# Altium project PCB_Project.PrjPcb
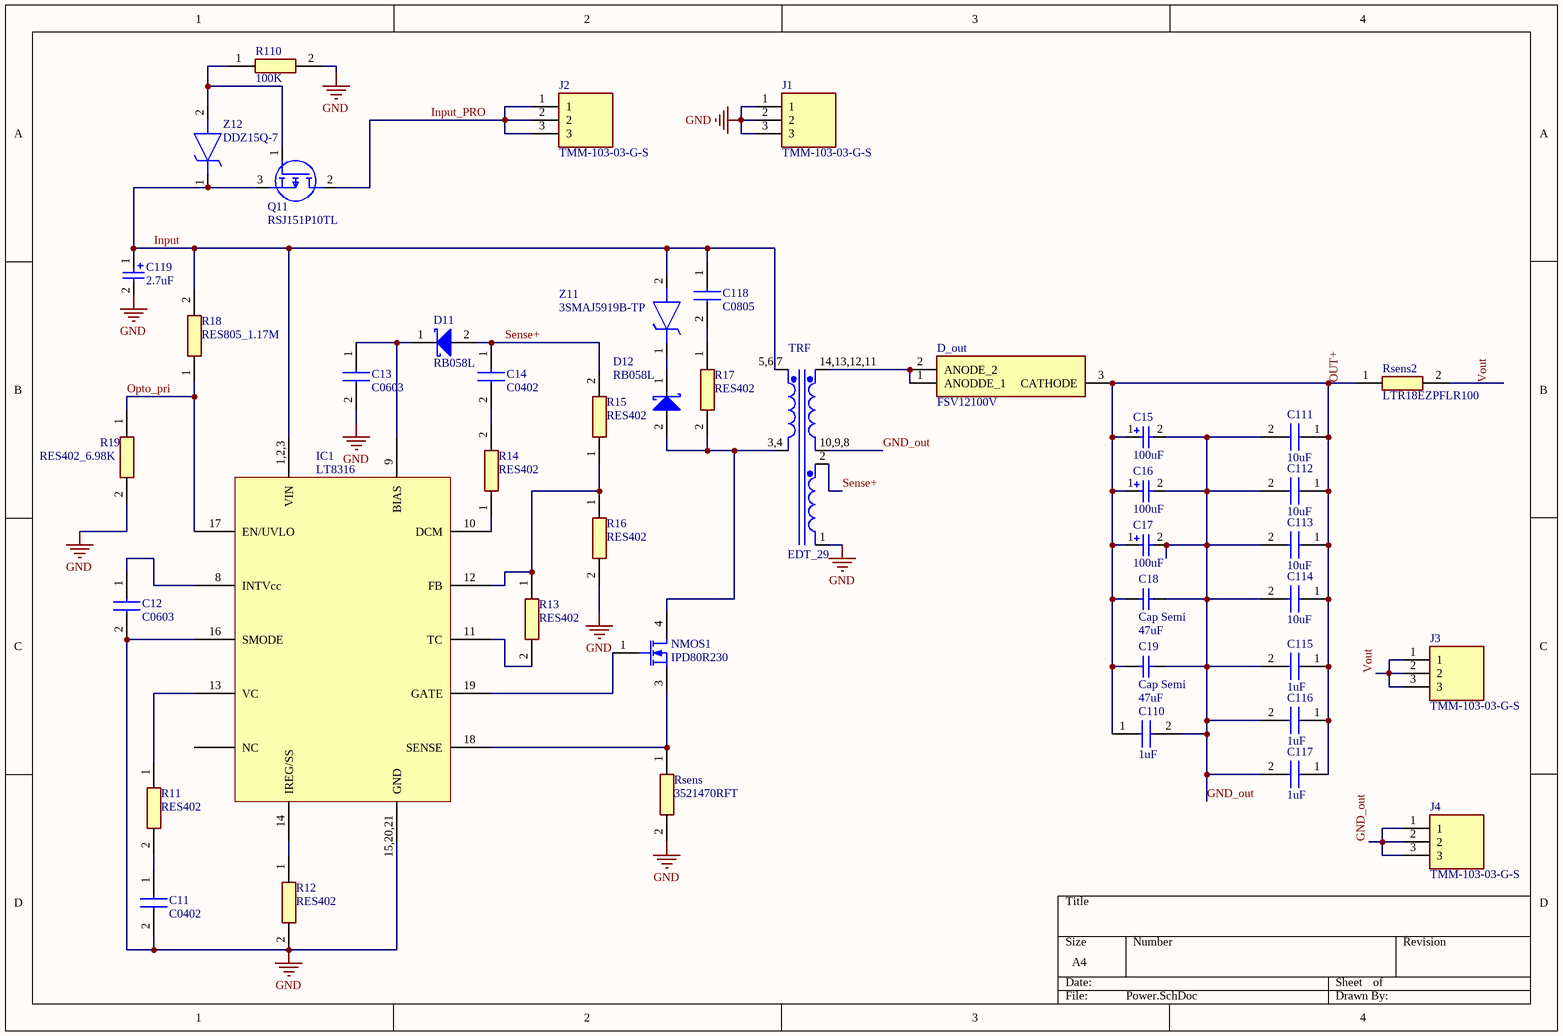
[diagram p0: Power.SchDoc]
2 sheets, 69 parts. Net scope: global (net labels, ports and power ports of the same name join across sheets).
Board file: PCB1.PcbDoc
Sheets:
  Power.SchDoc
  Control.SchDoc

## Sheet Power.SchDoc
size A4; SheetNumber: 1; SheetTotal: 2

### Parts
C11  C0402  [CAPC1005X55N]
C12  C0603  [CAPC1608X90N]
C13  C0603  [CAPC1608X90N]
C14  C0402  [CAPC1005X55N]
C15  100uF  [CAPAEDH107M016A9G]
C16  100uF  [CAPAEDH107M016A9G]
C17  100uF  [CAPAEDH107M016A9G]
C18  Cap Semi  value 47uF  [C1206]
C19  Cap Semi  value 47uF  [C1206]
C110  1uF  [CAPC1608X90N]
C111  10uF  [CAPC2012X145N]
C112  10uF  [CAPC2012X145N]
C113  10uF  [CAPC2012X145N]
C114  10uF  [CAPC2012X145N]
C115  1uF  [CAPC1608X90N]
C116  1uF  [CAPC1608X90N]
C117  1uF  [CAPC1608X90N]
C118  C0805  [CAPC2012X145N]
C119  2.7uF  [CAPAE127P600-8N]
D11  RB058L  [RB058L]
D12  RB058L  [RB058L]
D_out  FSV12100V  [FSV1045V]
IC1  LT8316  [TSOP65P640X120-20N]
J1  TMM-103-03-G-S  [HDRV3W50P0X200_1X3_600X197X550P]
J2  TMM-103-03-G-S  [HDRV3W50P0X200_1X3_600X197X550P]
J3  TMM-103-03-G-S  [HDRV3W50P0X200_1X3_600X197X550P]
J4  TMM-103-03-G-S  [HDRV3W50P0X200_1X3_600X197X550P]
NMOS1  IPD80R230  [DPAK228P994X241-3N]
Q11  RSJ151P10TL  [RSJ151P10TL]
R11  RES402  [ERJ2RKD1004X]
R12  RES402  [ERJ2RKD1004X]
R13  RES402  [ERJ2RKD1004X]
R14  RES402  [ERJ2RKD1004X]
R15  RES402  [ERJ2RKD1004X]
R16  RES402  [ERJ2RKD1004X]
R17  RES402  [ERJ2RKD1004X]
R18  RES805_1.17M  [RESC2012X50N]
R19  RES402_6.98K  [ERJ2RKD1004X]
R110  100K  [ERJ2RKD1004X]
Rsens  3521470RFT  [RESC6332X65N]
Rsens2  LTR18EZPFLR100  [RESC1632X68N]
TRF  EDT_29  [PCBComponent_1]
Z11  3SMAJ5919B-TP  [DIOM5226X244N]
Z12  DDZ15Q-7  [SOD3716X145N]

### Nets
GND: C11.2 C12.2 C13.2 C119.2(CAP-) IC1.15,20,21(GND) IC1.16(SMODE) J1.1 J1.2 J1.3 R12.2 R16.2 R19.2 R110.2 Rsens.2 TRF.1(Sec2-)
GND_out: C15.2(CAP-) C16.2(CAP-) C17.2(CAP-) C18.2 C19.2 C110.2 C111.2 C112.2 C113.2 C114.2 C115.2 C116.2 C117.2 J4.1 J4.2 J4.3 TRF.10,9,8(Sec1-)
Input: C118.1 C119.1(Cap+) IC1.1,2,3(VIN) Q11.3(S) R18.2 TRF.5,6,7(Pri+) Z11.2(A) Z12.1(K)
Input_PRO: J2.1 J2.2 J2.3 Q11.2(D)
Opto_pri: IC1.17(EN/UVLO) R18.1 R19.1
OUT+: C15.1(Cap+) C16.1(Cap+) C17.1(Cap+) C18.1 C19.1 C110.1 C111.1 C112.1 C113.1 C114.1 C115.1 C116.1 C117.1 D_out.3(CATHODE) Rsens2.1
Sense+: C14.1 D11.2(A) R15.2 TRF.2(Sec2+)
Vout: J3.1 J3.2 J3.3 Rsens2.2
NetC11_1: C11.1 R11.2
NetC12_1: C12.1 IC1.8(INTVcc)
NetC13_1: C13.1 D11.1(K) IC1.9(BIAS)
NetC14_2: C14.2 R14.2
NetC118_2: C118.2 R17.1
NetD12_1: D12.1(K) Z11.1(K)
NetD12_2: D12.2(A) NMOS1.4(D) R17.2 TRF.3,4(Pri-)
NetD_out_1: D_out.1(ANODDE_1) D_out.2(ANODE_2) TRF.14,13,12,11(Sec1+)
NetIC1_10: IC1.10(DCM) R14.1
NetIC1_11: IC1.11(TC) R13.2
NetIC1_12: IC1.12(FB) R13.1 R15.1 R16.1
NetIC1_13: IC1.13(VC) R11.1
NetIC1_14: IC1.14(IREG/SS) R12.1
NetIC1_18: IC1.18(SENSE) NMOS1.3(S) Rsens.1
NetIC1_19: IC1.19(GATE) NMOS1.1(G)
NetQ11_1: Q11.1(G) R110.1 Z12.2(A)

Not connected (* = marked no-connect by the designer): IC1 4,5,6,7(NC)

### Library data of the parts
C11 C14 = C0402C829D3GACTU: Capacitor; Manufacturer_Name: Kemet; Datasheet Link: https://content.kemet.com/datasheets/KEM_C1002_X7R_SMD.pdf; Height: 0.55mm; Manufacturer_Part_Number: C0402C829D3GACTU; Mouser Part Number: 80-C0402C829D3G; Mouser Price/Stock: https://www.mouser.co.uk/ProductDetail/KEMET/C0402C829D3GACTU?qs=ezuqA1hLDjkKgrGbHuNb0A%3D%3D; Arrow Part Number: C0402C829D3GACTU; Arrow Price/Stock: https://www.arrow.com/en/products/c0402c829d3gactu/kemet-corporation
C12 C13 C110 C115-C117 = CC0603KRX7R7BB103: Capacitor; Manufacturer_Name: YAGEO (PHYCOMP); Datasheet Link: http://www.yageo.com/documents/recent/UPY-GPHC_X7R_6.3V-to-50V_18.pdf; Height: 0.9mm; Manufacturer_Part_Number: CC0603KRX7R7BB103; Mouser Part Number: 603-CC603KRX7R7BB103; Mouser Price/Stock: https://www.mouser.co.uk/ProductDetail/Yageo/CC0603KRX7R7BB103?qs=5q%252BqlK8CmJRarFmz5k060w%3D%3D; Arrow Part Number: CC0603KRX7R7BB103; Arrow Price/Stock: https://www.arrow.com/en/products/cc0603krx7r7bb103/yageo
C15-C17 = CAPEDH107
C18 C19 = Cap Semi: Capacitor (Semiconductor SIM Model); Published: 8-Jun-2000; LatestRevisionDate: 29-May-2009; LatestRevisionNote: IPC-7351 Footprint Added.; PackageReference: C1206; Publisher: Altium Limited; PackageDescription: Chip Capacitor
C111-C114 C118 = GCG21BR71H154KA01K: Capacitor; Manufacturer_Name: Murata Electronics; Datasheet Link: https://psearch.en.murata.com/capacitor/product/GCG21BR71H154KA01%23.html; Height: 1.45mm; Manufacturer_Part_Number: GCG21BR71H154KA01K; Mouser Part Number: 81-GCG21BR71H154KA1K; Mouser Price/Stock: https://www.mouser.co.uk/ProductDetail/Murata-Electronics/GCG21BR71H154KA01K?qs=QzBtWTOodeWaaJ9cJuc7Gg%3D%3D; Arrow Part Number: GCG21BR71H154KA01K; Arrow Price/Stock: https://www.arrow.com/en/products/gcg21br71h154ka01k/murata-manufacturing
D_out = FSV12100V: Schottky Diode; Manufacturer_Name: ON Semiconductor; Datasheet Link: https://www.onsemi.com/pub/Collateral/FSV12100V-D.PDF; Height: 1.2mm; Manufacturer_Part_Number: FSV12100V; Mouser Part Number: 512-FSV12100V; Mouser Price/Stock: https://www.mouser.co.uk/ProductDetail/ON-Semiconductor-Fairchild/FSV12100V?qs=8Nc07tNByyHxUYQ9xyerWQ%3D%3D; Arrow Part Number: FSV12100V; Arrow Price/Stock: https://www.arrow.com/en/products/fsv12100v/on-semiconductor?region=nac
J1-J4 = TMM-103-03-G-S: Connector; Manufacturer_Name: SAMTEC; Datasheet Link: https://www.arrow.com/en/products/tmm-103-03-g-s/samtec; Height: 5.5mm; Manufacturer_Part_Number: TMM-103-03-G-S; Mouser Part Number: 200-TMM10303GS; Mouser Price/Stock: https://www.mouser.co.uk/ProductDetail/Samtec/TMM-103-03-G-S?qs=fnpEE5GccuM0dk34m8SAnQ%3D%3D; Arrow Part Number: TMM-103-03-G-S; Arrow Price/Stock: https://www.arrow.com/en/products/tmm-103-03-g-s/samtec
NMOS1 = IPD80R230: Power Mosfet
Q11 = RSJ151P10TL: MOSFET (P-Channel); Manufacturer_Name: ROHM Semiconductor; Datasheet Link: https://componentsearchengine.com/Datasheets/1/RSJ151P10TL.pdf; Height: 2mm; Manufacturer_Part_Number: RSJ151P10TL; Mouser Part Number: 755-RSJ151P10TL; Mouser Price/Stock: https://www.mouser.co.uk/ProductDetail/ROHM-Semiconductor/RSJ151P10TL?qs=npTsUczJOtN3pQwAwZe%252BkQ%3D%3D
R11-R17 R19 R110 = ERJ2RKF4023X: Resistor; Manufacturer_Name: Panasonic; Datasheet Link: http://docs-europe.electrocomponents.com/webdocs/13ba/0900766b813ba21b.pdf; Height: 0.4mm; Manufacturer_Part_Number: ERJ2RKF4023X
R18 = CRCW0805160RFKEA: Resistor; Manufacturer_Name: Vishay; Datasheet Link: http://www.vishay.com/docs/20035/dcrcwe3.pdf; Height: 0.5mm; Manufacturer_Part_Number: CRCW0805160RFKEA; Mouser Part Number: 71-CRCW0805160RFKEA; Mouser Price/Stock: https://www.mouser.co.uk/ProductDetail/Vishay-Dale/CRCW0805160RFKEA?qs=bMjB6bAaLENAK7tiR9oJIA%3D%3D; Arrow Part Number: CRCW0805160RFKEA; Arrow Price/Stock: https://www.arrow.com/en/products/crcw0805160rfkea/vishay
Rsens = 3521470RFT: Resistor; Manufacturer_Name: TE Connectivity; Datasheet Link: http://docs-emea.rs-online.com/webdocs/1096/0900766b81096b90.pdf; Height: 0.65mm; Manufacturer_Part_Number: 3521470RFT; Mouser Part Number: 279-3521470RFT; Mouser Price/Stock: https://www.mouser.com/Search/Refine.aspx?Keyword=279-3521470RFT; Arrow Part Number: 3521470RFT; Arrow Price/Stock: https://www.arrow.com/en/products/3521470rft/te-connectivity
Rsens2 = LTR18EZPFLR100: Resistor; Manufacturer_Name: ROHM Semiconductor; Datasheet Link: https://componentsearchengine.com/Datasheets/1/LTR18EZPFLR100.pdf; Height: 0.68mm; Manufacturer_Part_Number: LTR18EZPFLR100; Mouser Part Number: 755-LTR18EZPFLR100; Mouser Price/Stock: https://www.mouser.co.uk/ProductDetail/ROHM-Semiconductor/LTR18EZPFLR100?qs=493kPxzlxfIvjOOFIGs2zg%3D%3D
TRF = EDT_29: Transformer
Z11 = 3SMAJ5919B-TP: Zener Diode; Manufacturer_Name: Micro Commercial Components (MCC); Datasheet Link: https://componentsearchengine.com/Datasheets/1/3SMAJ5919B-TP.pdf; Height: 2.44mm; Manufacturer_Part_Number: 3SMAJ5919B-TP; Mouser Part Number: 833-3SMAJ5919B-TP; Mouser Price/Stock: https://www.mouser.co.uk/ProductDetail/Micro-Commercial-Components-MCC/3SMAJ5919B-TP?qs=ZNK0BnemlqFOug%252B1FuXOvQ%3D%3D; Arrow Part Number: 3SMAJ5919B-TP; Arrow Price/Stock: https://www.arrow.com/en/products/3smaj5919b-tp/micro-commercial-components
Z12 = DDZ15Q-7: Zener Diode; Manufacturer_Name: Diodes Inc.; Datasheet Link: https://www.diodes.com/assets/Datasheets/Ds30407.pdf; Height: 1.45mm; Manufacturer_Part_Number: DDZ15Q-7; Mouser Part Number: 621-DDZ15Q-7; Mouser Price/Stock: https://www.mouser.co.uk/ProductDetail/Diodes-Incorporated/DDZ15Q-7?qs=26fMNUst%2FUDpVXvTBmYYxg%3D%3D

## Sheet Control.SchDoc
size A4; SheetNumber: 2; SheetTotal: 2
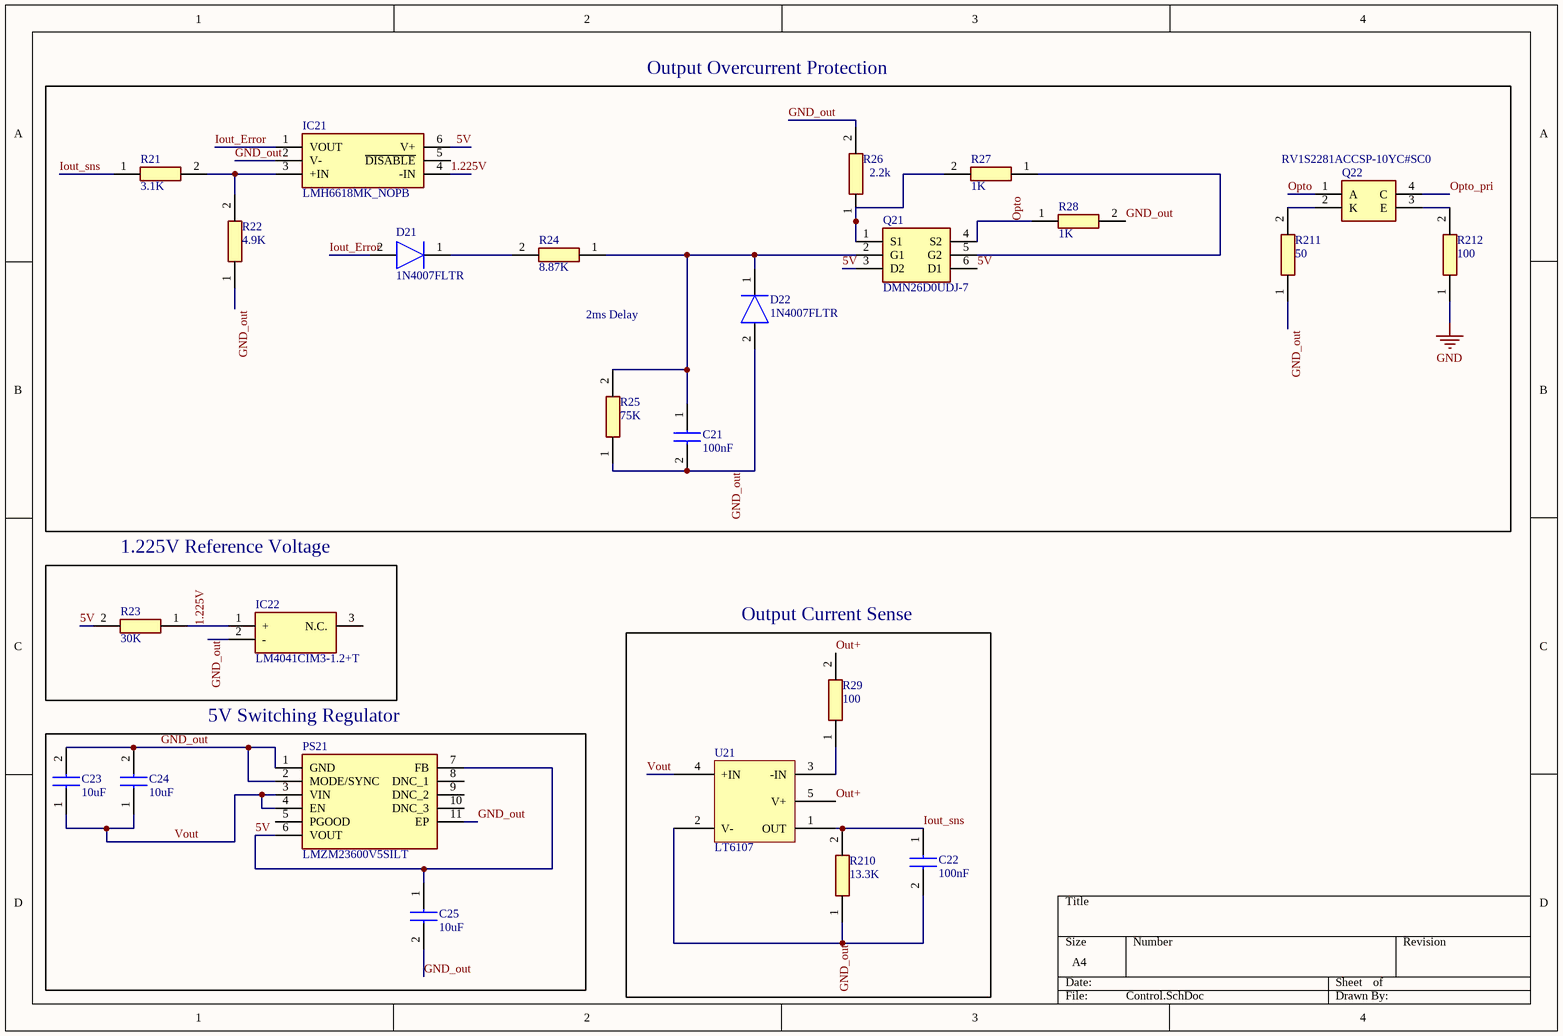
[diagram p1: Control.SchDoc]

### Parts
C21  100nF  [CAPC1005X55N]
C22  100nF  [CAPC1005X55N]
C23  10uF  [CAPC2012X145N]
C24  10uF  [CAPC2012X145N]
C25  10uF  [CAPC2012X145N]
D21  1N4007FLTR  [SODFL3718X140N]
D22  1N4007FLTR  [SODFL3718X140N]
IC21  LMH6618MK_NOPB  [SOT95P280X110-6N]
IC22  LM4041CIM3-1.2+T  [SOT95P237X112-3N]
PS21  LMZM23600V5SILT  [LMZM23600SILT]
Q21  DMN26D0UDJ-7  [SOTFL35P100X50-6N]
Q22  RV1S2281ACCSP-10YC#SC0  [SOP130P1020X210-4N]
R21  3.1K  [ERJ2RKD1004X]
R22  4.9K  [ERJ2RKD1004X]
R23  30K  [ERJ2RKD1004X]
R24  8.87K  [ERJ2RKD1004X]
R25  75K  [ERJ2RKD1004X]
R26  2.2k  [ERJ2RKD1004X]
R27  1K  [ERJ2RKD1004X]
R28  1K  [ERJ2RKD1004X]
R29  100  [ERJ2RKD1004X]
R210  13.3K  [ERJ2RKD1004X]
R211  50  [ERJ2RKD1004X]
R212  100  [ERJ2RKD1004X]
U21  LT6107  [SOT95P245X110-5N]

### Blocks framed on the sheet
Output Overcurrent Protection: C21 D21 D22 IC21 Q21 Q22 R21 R22 R24-R28 R211 R212
1.225V Reference Voltage: IC22 R23
Output Current Sense: C22 R29 R210 U21
5V Switching Regulator: C23-C25 PS21

### Nets
GND: R212.1
1.225V: IC21.4(-IN) IC22.1(+) R23.1
5V: C25.1 IC21.6(V+) PS21.6(VOUT) PS21.7(FB) Q21.3(D2) Q21.6(D1) R23.2
GND_out: C21.2 C22.2 C23.2 C24.2 C25.2 D22.2(A) IC21.2(V-) IC22.2(-) PS21.1(GND) PS21.2(MODE/SYNC) PS21.11(EP) R22.1 R25.1 R26.2 R28.2 R210.1 R211.1 U21.2(V-)
Iout_Error: D21.2(A) IC21.1(VOUT)
Iout_sns: C22.1 R21.1 R210.2 U21.1(OUT)
Opto: Q21.4(S2) Q22.1(A) R28.1
Opto_pri: Q22.4(C)
OUT+: R29.2 U21.5(V+)
Vout: C23.1 C24.1 PS21.3(VIN) PS21.4(EN) U21.4(+IN)
NetC21_1: C21.1 D22.1(K) Q21.2(G1) R24.1 R25.2
NetD21_1: D21.1(K) R24.2
NetIC21_3: IC21.3(+IN) R21.2 R22.2
NetQ21_1: Q21.1(S1) R26.1 R27.2
NetQ21_5: Q21.5(G2) R27.1
NetQ22_2: Q22.2(K) R211.2
NetQ22_3: Q22.3(E) R212.2
NetR29_1: R29.1 U21.3(-IN)

Not connected (* = marked no-connect by the designer): IC21 5(~{DISABLE}); IC22 3(N.C.); PS21 5(PGOOD) 8(DNC_1) 9(DNC_2) 10(DNC_3)

### Notes on the sheet
- 2ms Delay

### Library data of the parts
C21 C22 = C0402C829D3GACTU: Capacitor; Manufacturer_Name: Kemet; Datasheet Link: https://content.kemet.com/datasheets/KEM_C1002_X7R_SMD.pdf; Height: 0.55mm; Manufacturer_Part_Number: C0402C829D3GACTU; Mouser Part Number: 80-C0402C829D3G; Mouser Price/Stock: https://www.mouser.co.uk/ProductDetail/KEMET/C0402C829D3GACTU?qs=ezuqA1hLDjkKgrGbHuNb0A%3D%3D; Arrow Part Number: C0402C829D3GACTU; Arrow Price/Stock: https://www.arrow.com/en/products/c0402c829d3gactu/kemet-corporation
C23-C25 = GCG21BR71H154KA01K: as C111 on sheet Power; Datasheet Link: https://psearch.en.murata.com/capacitor/product/GCG21BR71H154KA01%23.html; Height: 1.45mm; Manufacturer_Part_Number: GCG21BR71H154KA01K; Mouser Part Number: 81-GCG21BR71H154KA1K; Mouser Price/Stock: https://www.mouser.co.uk/ProductDetail/Murata-Electronics/GCG21BR71H154KA01K?qs=QzBtWTOodeWaaJ9cJuc7Gg%3D%3D; Arrow Part Number: GCG21BR71H154KA01K; Arrow Price/Stock: https://www.arrow.com/en/products/gcg21br71h154ka01k/murata-manufacturing
D21 D22 = 1N4007FLTR: Diode; Manufacturer_Name: SMC; Datasheet Link: http://www.smc-diodes.com/propdf/1N4001FL-1N4007FL%20N1646%20REV.A.pdf; Height: 1.4mm; Manufacturer_Part_Number: 1N4007FLTR
IC21 = LMH6618MK_NOPB: Integrated Circuit; Manufacturer_Name: Texas Instruments; Manufacturer_Part_Number: LMH6618MK/NOPB; Datasheet Link: http://www.ti.com/lit/ds/symlink/lmh6618.pdf; Height: 1.1mm; Mouser Part Number: 926-LMH6618MK/NOPB; Mouser Price/Stock: https://www.mouser.co.uk/ProductDetail/Texas-Instruments/LMH6618MK-NOPB?qs=7lkVKPoqpbaHKIKeeUkpDw%3D%3D; Arrow Part Number: LMH6618MK/NOPB; Arrow Price/Stock: https://www.arrow.com/en/products/lmh6618mknopb/texas-instruments?region=nac
IC22 = LM4041CIM3-1.2+T: Integrated Circuit; Manufacturer_Name: Maxim Integrated; Datasheet Link: https://pdfserv.maximintegrated.com/en/ds/LM4041.pdf; Height: 1.12mm; Manufacturer_Part_Number: LM4041CIM3-1.2+T; Mouser Part Number: 700-LM4041CIM3-1.2T; Mouser Price/Stock: https://www.mouser.co.uk/ProductDetail/Maxim-Integrated/LM4041CIM3-12%2bT?qs=GxOUx7aO6nzSYD%252Bwc9k7xw%3D%3D
PS21 = LMZM23600V5SILT: Power Supply; Manufacturer_Name: Texas Instruments; Datasheet Link: https://componentsearchengine.com/Datasheets/2/LMZM23600V5SILT.pdf; Height: 1.578mm; Manufacturer_Part_Number: LMZM23600V5SILT; Mouser Part Number: 595-LMZM23600V5SILT; Mouser Price/Stock: https://www.mouser.co.uk/ProductDetail/Texas-Instruments/LMZM23600V5SILT?qs=55YtniHzbhCr0j8%2FvNPzJg%3D%3D; Arrow Part Number: LMZM23600V5SILT; Arrow Price/Stock: https://www.arrow.com/en/products/lmzm23600v5silt/texas-instruments?region=nac
Q21 = DMN26D0UDJ-7: MOSFET (N-Channel); Manufacturer_Name: Diodes Inc.; Datasheet Link: https://www.diodes.com/assets/Datasheets/ds31481.pdf; Height: 0.5mm; Manufacturer_Part_Number: DMN26D0UDJ-7; Mouser Part Number: 621-DMN26D0UDJ-7; Mouser Price/Stock: https://www.mouser.co.uk/ProductDetail/Diodes-Incorporated/DMN26D0UDJ-7?qs=VJbqQHImxEwYAK9Ioc59og%3D%3D; Arrow Part Number: DMN26D0UDJ-7; Arrow Price/Stock: https://www.arrow.com/en/products/dmn26d0udj-7/diodes-incorporated?region=nac
Q22 = RV1S2281ACCSP-10YC#SC0: Transistor; Manufacturer_Name: Renesas Electronics; Datasheet Link: https://www.renesas.com/in/en/doc/products/opt/r08ds0185ej0100-rv1s2281a.pdf; Height: 2.1mm; Manufacturer_Part_Number: RV1S2281ACCSP-10YC#SC0; Mouser Part Number: 968-2281ACCSP10YCSC0; Mouser Price/Stock: https://www.mouser.co.uk/ProductDetail/Renesas-Electronics/RV1S2281ACCSP-10YCSC0?qs=wnTfsH77Xs7B5%2FobUeyKWw%3D%3D
R21-R29 R210-R212 = ERJ2RKF4023X: Resistor; Manufacturer_Name: Panasonic; Datasheet Link: http://docs-europe.electrocomponents.com/webdocs/13ba/0900766b813ba21b.pdf; Height: 0.4mm; Manufacturer_Part_Number: ERJ2RKF4023X

## Nets that join several sheets
GND: Power (15 pins), Control (R212.1)
GND_out: Power (17 pins), Control (18 pins)
Opto_pri: Power (IC1.17 R18.1 R19.1), Control (Q22.4)
OUT+: Power (15 pins), Control (R29.2 U21.5)
Vout: Power (J3.1 J3.2 J3.3 Rsens2.2), Control (5 pins)